# EAGLE board domeLedPcb (EAGLE 7.5.0), part 1 of 2
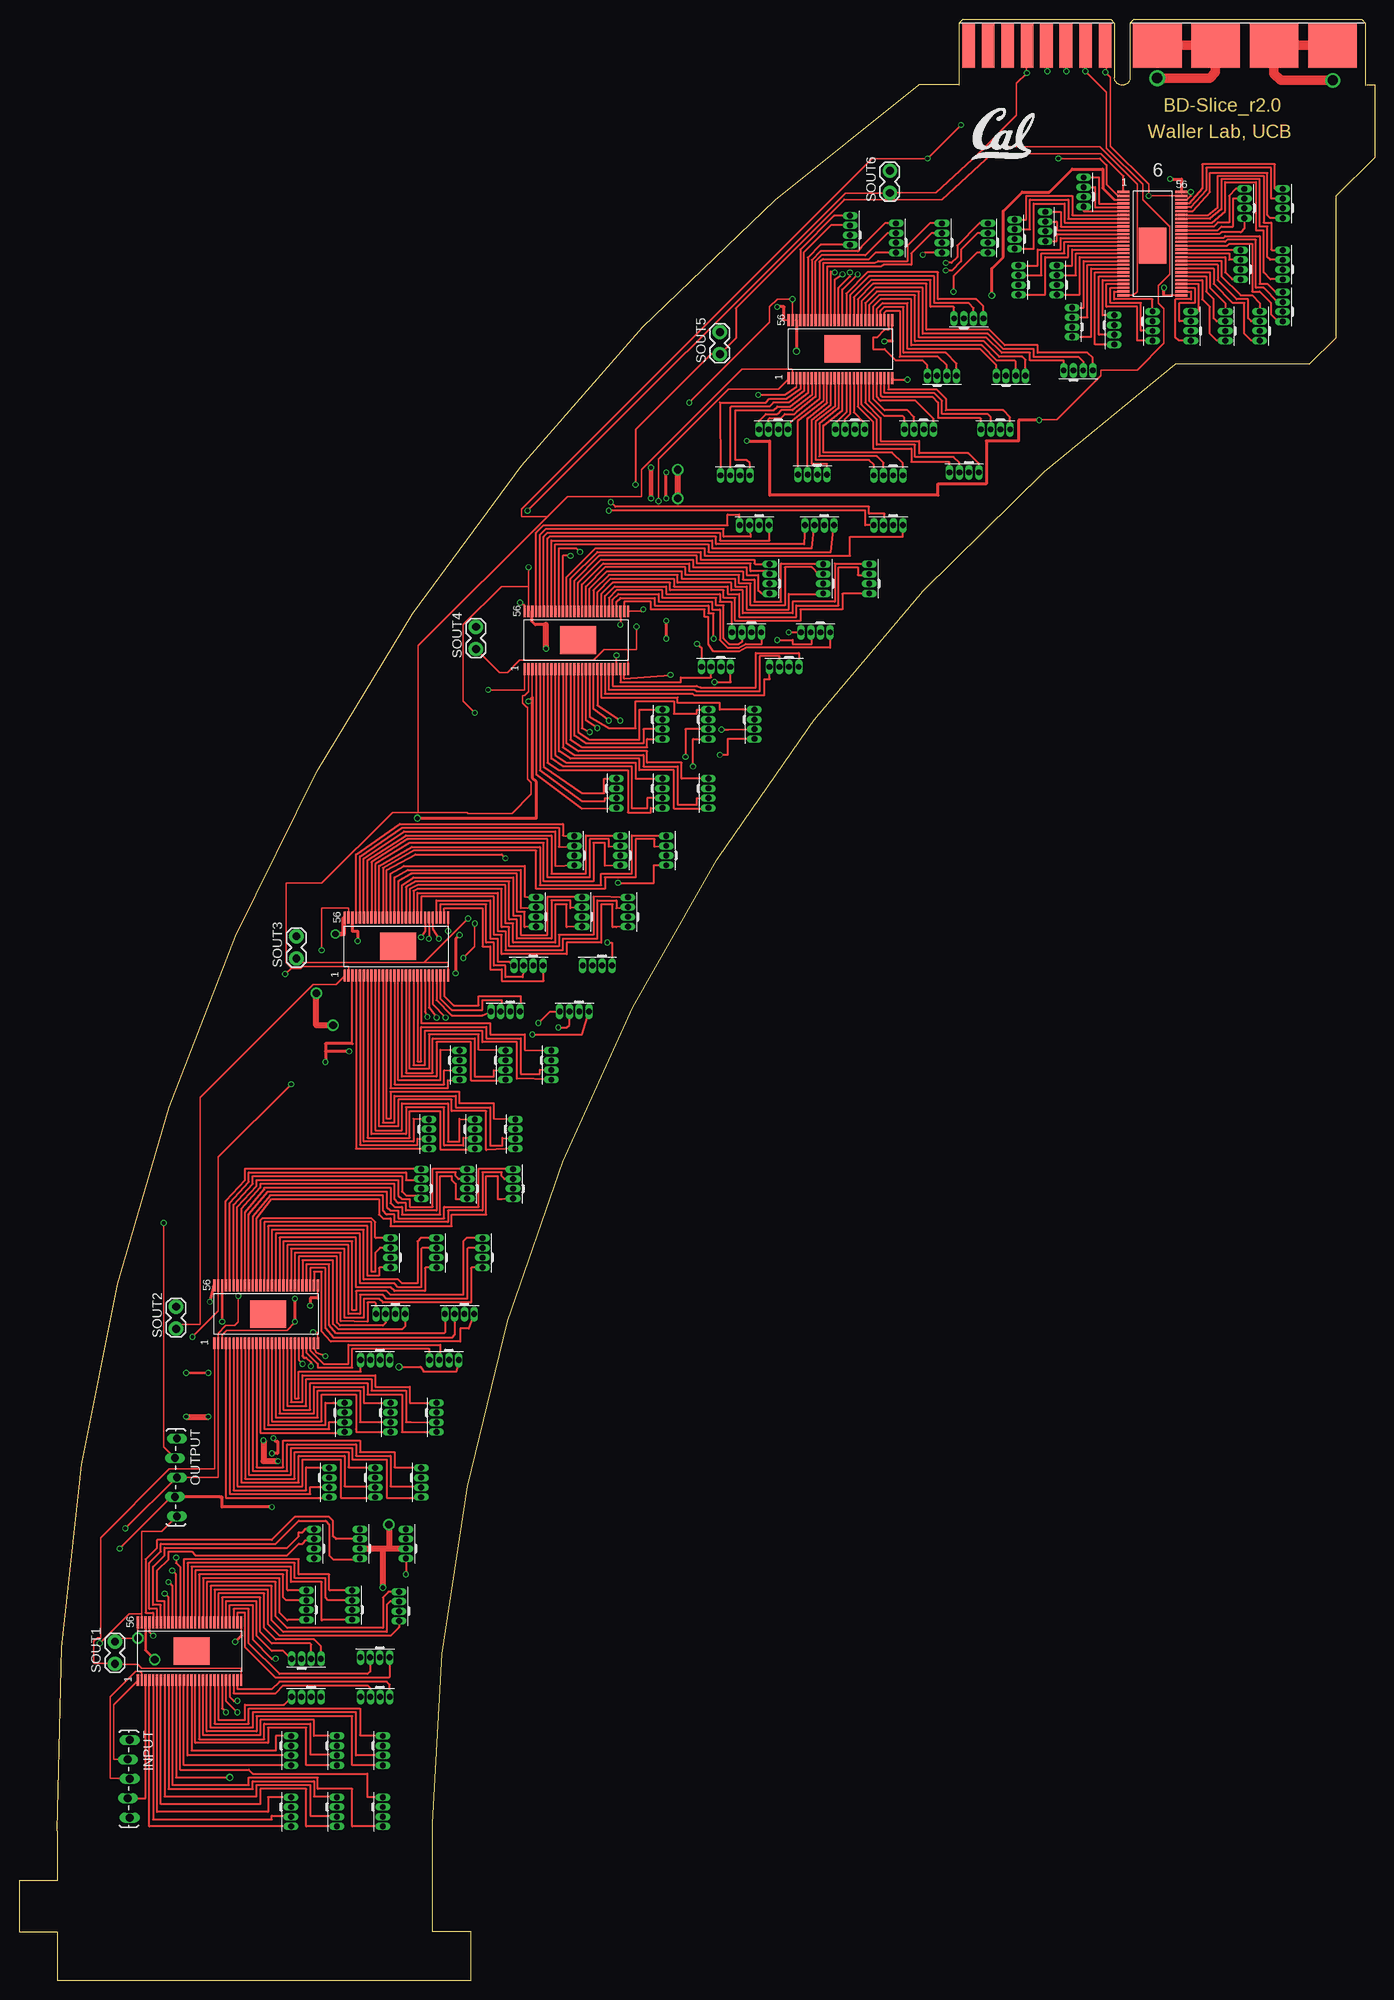
[diagram p5: board, top side]
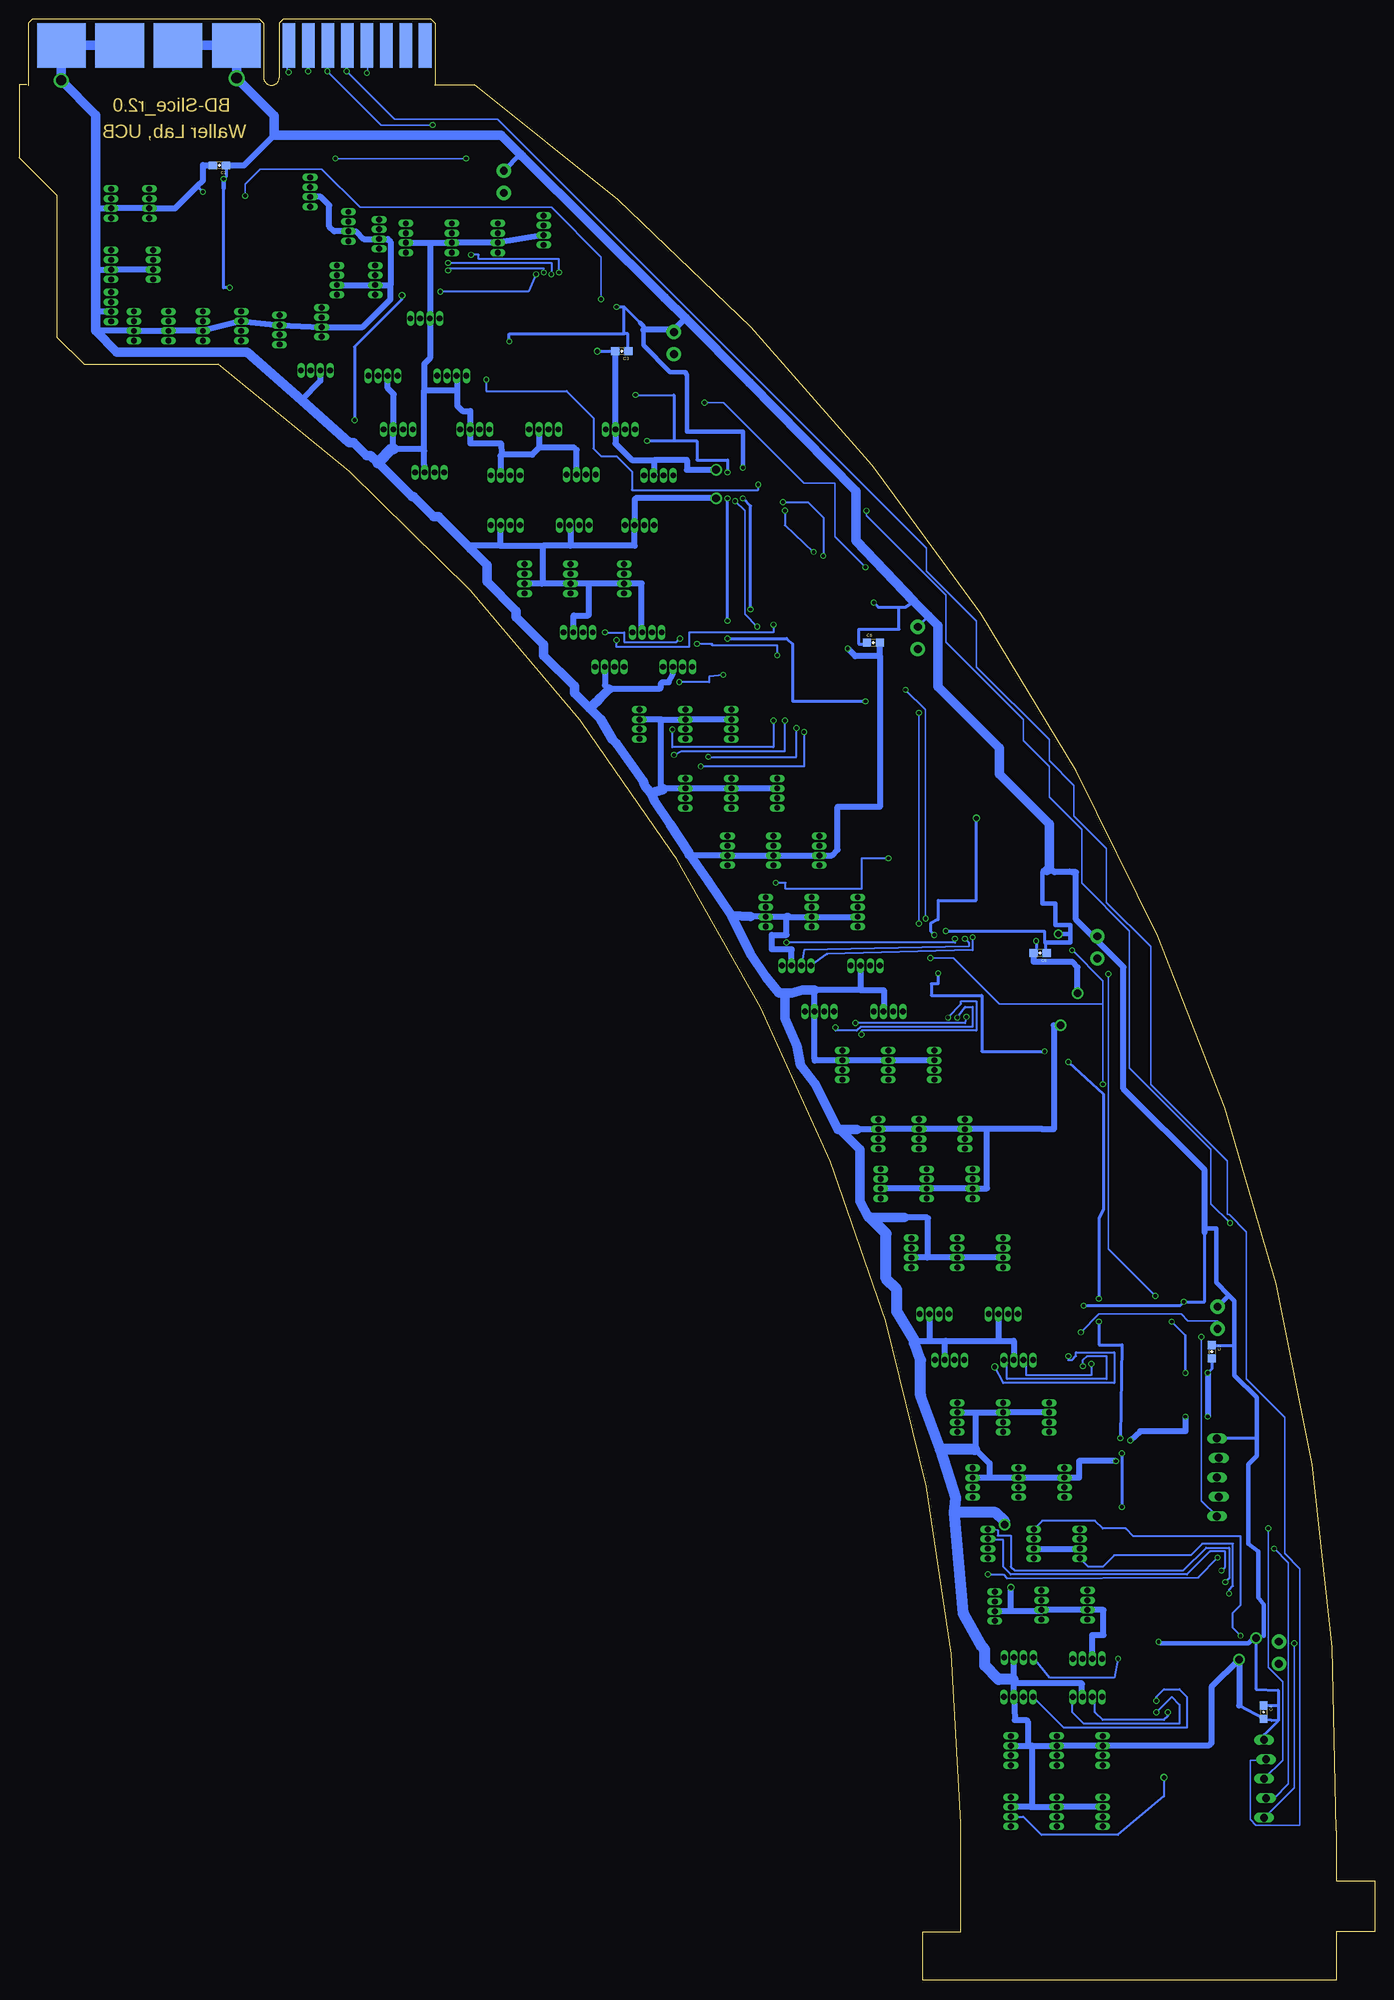
[diagram p6: board, bottom side, seen from below]

Size 177 x 256.07 mm. Coordinates in mm from the lower left corner, seen from the top.
Outline: 176,247.5 177,247.5 177,238 172,233 172,214.5 168.5,211 151,211 arc53 54,20.5 54,6.35 59,6.35 59,0 5,0 5,6.35 0,6.35 0,13 5,13 5,19.5 arc-55 117.5,247.5 122.72,247.5 122.71,247.41
Copper layers (1*16): Top 0.035mm / dielectric 1.5mm / Bottom 0.035mm
Design rules "SparkFun *": minimum track width 8mil, minimum drill 20mil, track to track 8mil, track to pad 8mil, pad to pad 8mil, via to via 8mil, smd to smd 8mil, copper to edge 10mil, drill to drill 8mil, minimum pad ring 0mil, minimum via ring 0mil, stop-mask expansion 4mil, vias tented up to drill 25mil, thermal gap 10mil

## Footprints (pad centres in the part's own frame; a part is rotated, then mirrored left to right if it is on the bottom)
4POWER_8SIGNAL = smd 6.35 x 5.842 bottom: A1_B -27.432,-0.381; A2_B -19.812,-0.381; A3_B -12.192,-0.381; A4_B -4.572,-0.381 | smd 6.35 x 5.842: A1_T -27.432,-0.381; A2_T -19.812,-0.381; A3_T -12.192,-0.381; A4_T -4.572,-0.381 | smd 1.651 x 5.842 bottom: B1_B 2.261,-0.381; B2_B 4.801,-0.381; B3_B 7.366,-0.381; B4_B 9.906,-0.381; B5_B 12.446,-0.381; B6_B 14.986,-0.381; B7_B 17.526,-0.381; B8_B 20.066,-0.381 | smd 1.651 x 5.842: B1_T 2.261,-0.381; B2_T 4.801,-0.381; B3_T 7.366,-0.381; B4_T 9.906,-0.381; B5_T 12.446,-0.381; B6_T 14.986,-0.381; B7_T 17.526,-0.381; B8_T 20.066,-0.381
0603-CAP = smd 1.1 x 1: 1 -0.85,0; 2 0.85,0
56-HTSSOP = smd 0.3 x 1.55: P1 -7,-3.8; P2 -6.5,-3.8; P3 -6,-3.8; P4 -5.5,-3.8; P5 -5,-3.8; P6 -4.5,-3.8; P7 -4,-3.8; P8 -3.5,-3.8; P9 -3,-3.8; P10 -2.5,-3.8; P11 -2,-3.8; P12 -1.5,-3.8; P13 -1,-3.8; P14 -0.5,-3.8; P15 0,-3.8; P16 0.5,-3.8; P17 1,-3.8; P18 1.5,-3.8; P19 2,-3.8; P20 2.5,-3.8; P21 3,-3.8; P22 3.5,-3.8; P23 4,-3.8; P24 4.5,-3.8; P25 5,-3.8; P26 5.5,-3.8; P27 6,-3.8; P28 6.5,-3.8; P29 6.5,3.75; P30 6,3.75; P31 5.5,3.75; P32 5,3.75; P33 4.5,3.75; P34 4,3.75; P35 3.5,3.75; P36 3,3.75; P37 2.5,3.75; P38 2,3.75; P39 1.5,3.75; P40 1,3.75; P41 0.5,3.75; P42 0,3.75; P43 -0.5,3.75; P44 -1,3.75; P45 -1.5,3.75; P46 -2,3.75; P47 -2.5,3.75; P48 -3,3.75; P49 -3.5,3.75; P50 -4,3.75; P51 -4.5,3.75; P52 -5,3.75; P53 -5.5,3.75; P54 -6,3.75; P55 -6.5,3.75; P56 -7,3.75 | smd 4.7 x 3.6: POWER_PAD 0,0
LED-RGB-THRU = drill 0.762 pad 0.889 long: 1 1.905,0; 2 0.635,0; 3 -0.635,0; 4 -1.905,0
1X05_LOCK_LONGPADS = drill 1.016 long: 1 0,0; 2 2.54,-0.254; 3 5.08,0; 4 7.62,-0.254; 5 10.16,0
1X02_LOCK = drill 1.016 pad 1.88: 1 -0.178,0; 2 2.718,0

## Placement (x,y rotation side)
BASE_CONNECTOR  4POWER_8SIGNALMATING_BOARD  [4POWER_8SIGNAL]  144.05,252.26 180 top
C1  0.1uF  [0603-CAP]  150.83,236.98 180 bottom
C2  0.1uF  [0603-CAP]  21.25,82.06 270 bottom
C3  0.1uF  [0603-CAP]  98.29,212.71 180 bottom
C4  0.1uF  [0603-CAP]  14.5,35 270 bottom
C5  0.1uF  [0603-CAP]  65.45,174.66 0 bottom
C6  0.1uF  [0603-CAP]  43.69,134.14 180 bottom
CHIP_1  TLC5955V0  [56-HTSSOP]  22.5,43 0 top
CHIP_2  TLC5955V0  [56-HTSSOP]  32.5,87 0 top
CHIP_3  TLC5955V0  [56-HTSSOP]  49.5,135 0 top
CHIP_4  TLC5955V0  [56-HTSSOP]  73,175 0 top
CHIP_5  TLC5955V0  [56-HTSSOP]  107.5,213 0 top
CHIP_6  TLC5955V0  [56-HTSSOP]  148,226.5 270 top
D1  LED-RGB-CC-THRUCLEAR  [LED-RGB-THRU]  159.5,224 270 top
D2  LED-RGB-CC-THRUCLEAR  [LED-RGB-THRU]  162,216 270 top
D3  LED-RGB-CC-THRUCLEAR  [LED-RGB-THRU]  137.5,216.5 270 top
D4  LED-RGB-CC-THRUCLEAR  [LED-RGB-THRU]  153,216 270 top
D5  LED-RGB-CC-THRUCLEAR  [LED-RGB-THRU]  165,232 270 top
D6  LED-RGB-CC-THRUCLEAR  [LED-RGB-THRU]  160,232 270 top
D7  LED-RGB-CC-THRUCLEAR  [LED-RGB-THRU]  135.5,222 270 top
D8  LED-RGB-CC-THRUCLEAR  [LED-RGB-THRU]  134,229 270 top
D9  LED-RGB-CC-THRUCLEAR  [LED-RGB-THRU]  157.5,216 270 top
D10  LED-RGB-CC-THRUCLEAR  [LED-RGB-THRU]  130,228 270 top
D11  LED-RGB-CC-THRUDIFFUSE  [LED-RGB-THRU]  130.5,222 270 top
D12  LED-RGB-CC-THRUCLEAR  [LED-RGB-THRU]  148,216 90 top
D13  LED-RGB-CC-THRUCLEAR  [LED-RGB-THRU]  165,218.5 270 top
D14  LED-RGB-CC-THRUCLEAR  [LED-RGB-THRU]  165,224 270 top
D15  LED-RGB-CC-THRUCLEAR  [LED-RGB-THRU]  143,215.5 90 top
D16  LED-RGB-CC-THRUCLEAR  [LED-RGB-THRU]  139,233.5 270 top
D17  LED-RGB-CC-THRUCLEAR  [LED-RGB-THRU]  105,183 270 top
D18  LED-RGB-CC-THRUCLEAR  [LED-RGB-THRU]  111,183 270 top
D19  LED-RGB-CC-THRUCLEAR  [LED-RGB-THRU]  96,164 90 top
D20  LED-RGB-CC-THRUCLEAR  [LED-RGB-THRU]  104,176 0 top
D21  LED-RGB-CC-THRUCLEAR  [LED-RGB-THRU]  96,190 0 top
D22  LED-RGB-CC-THRUCLEAR  [LED-RGB-THRU]  113.5,190 0 top
D23  LED-RGB-CC-THRUCLEAR  [LED-RGB-THRU]  90,164 90 top
D24  LED-RGB-CC-THRUCLEAR  [LED-RGB-THRU]  90,155 90 top
D25  LED-RGB-CC-THRUCLEAR  [LED-RGB-THRU]  95,176 0 top
D26  LED-RGB-CC-THRUCLEAR  [LED-RGB-THRU]  84,155 90 top
D27  LED-RGB-CC-THRUCLEAR  [LED-RGB-THRU]  84,164 90 top
D28  LED-RGB-CC-THRUCLEAR  [LED-RGB-THRU]  91,171.5 0 top
D29  LED-RGB-CC-THRUCLEAR  [LED-RGB-THRU]  98,183 270 top
D30  LED-RGB-CC-THRUCLEAR  [LED-RGB-THRU]  104.5,190 0 top
D31  LED-RGB-CC-THRUCLEAR  [LED-RGB-THRU]  99.9,171.5 0 top
D32  LED-RGB-CC-THRUCLEAR  [LED-RGB-THRU]  78,155 90 top
D33  LED-RGB-CC-THRUCLEAR  [LED-RGB-THRU]  124,217 180 top
D34  LED-RGB-CC-THRUCLEAR  [LED-RGB-THRU]  138.3,210.2 180 top
D35  1  [LED-RGB-THRU]  123.4,196.9 0 top
D36  LED-RGB-CC-THRUCLEAR  [LED-RGB-THRU]  120.5,209.5 180 top
D37  LED-RGB-CC-THRUCLEAR  [LED-RGB-THRU]  108.5,228.5 270 top
D38  LED-RGB-CC-THRUCLEAR  [LED-RGB-THRU]  120.5,227.5 270 top
D39  LED-RGB-CC-THRUCLEAR  [LED-RGB-THRU]  108.5,202.5 0 top
D40  LED-RGB-CC-THRUCLEAR  [LED-RGB-THRU]  103.6,196.6 0 top
D41  LED-RGB-CC-THRUCLEAR  [LED-RGB-THRU]  129.5,209.5 180 top
D42  LED-RGB-CC-THRUCLEAR  [LED-RGB-THRU]  98.5,202.5 0 top
D43  LED-RGB-CC-THRUCLEAR  [LED-RGB-THRU]  113.5,196.5 0 top
D44  LED-RGB-CC-THRUCLEAR  [LED-RGB-THRU]  127.5,202.5 0 top
D45  LED-RGB-CC-THRUCLEAR  [LED-RGB-THRU]  126.5,227.5 270 top
D46  LED-RGB-CC-THRUCLEAR  [LED-RGB-THRU]  114.5,227.5 270 top
D47  LED-RGB-CC-THRUCLEAR  [LED-RGB-THRU]  117.5,202.5 0 top
D48  LED-RGB-CC-THRUCLEAR  [LED-RGB-THRU]  93.5,196.5 0 top
D49  LED-RGB-CC-THRUCLEAR  [LED-RGB-THRU]  37.5,49 270 top
D50  LED-RGB-CC-THRUCLEAR  [LED-RGB-THRU]  49.6,48.83 270 top
D51  LED-RGB-CC-THRUCLEAR  [LED-RGB-THRU]  47.5,30 90 top
D52  LED-RGB-CC-THRUCLEAR  [LED-RGB-THRU]  46.47,42.16 0 top
D53  LED-RGB-CC-THRUCLEAR  [LED-RGB-THRU]  44.5,57 270 top
D54  LED-RGB-CC-THRUCLEAR  [LED-RGB-THRU]  50.5,57 270 top
D55  LED-RGB-CC-THRUCLEAR  [LED-RGB-THRU]  41.5,30 90 top
D56  LED-RGB-CC-THRUCLEAR  [LED-RGB-THRU]  47.5,22 90 top
D57  LED-RGB-CC-THRUCLEAR  [LED-RGB-THRU]  37.5,42 180 top
D58  LED-RGB-CC-THRUCLEAR  [LED-RGB-THRU]  41.5,22 90 top
D59  LED-RGB-CC-THRUCLEAR  [LED-RGB-THRU]  35.5,30 90 top
D60  LED-RGB-CC-THRUCLEAR  [LED-RGB-THRU]  46.5,37 0 top
D61  LED-RGB-CC-THRUCLEAR  [LED-RGB-THRU]  43.5,49 270 top
D62  LED-RGB-CC-THRUCLEAR  [LED-RGB-THRU]  38.5,57 270 top
D63  LED-RGB-CC-THRUCLEAR  [LED-RGB-THRU]  37.5,37 0 top
D64  LED-RGB-CC-THRUCLEAR  [LED-RGB-THRU]  35.5,22 90 top
D65  LED-RGB-CC-THRUCLEAR  [LED-RGB-THRU]  54.5,95 270 top
D66  LED-RGB-CC-THRUCLEAR  [LED-RGB-THRU]  60.5,95 270 top
D67  LED-RGB-CC-THRUCLEAR  [LED-RGB-THRU]  54.5,73.5 90 top
D68  LED-RGB-CC-THRUCLEAR  [LED-RGB-THRU]  57.5,87 0 top
D69  LED-RGB-CC-THRUCLEAR  [LED-RGB-THRU]  52.5,104 270 top
D70  LED-RGB-CC-THRUCLEAR  [LED-RGB-THRU]  64.5,104 270 top
D71  LED-RGB-CC-THRUCLEAR  [LED-RGB-THRU]  48.5,73.5 90 top
D72  LED-RGB-CC-THRUCLEAR  [LED-RGB-THRU]  52.5,65 90 top
D73  LED-RGB-CC-THRUCLEAR  [LED-RGB-THRU]  48.5,87 0 top
D74  LED-RGB-CC-THRUCLEAR  [LED-RGB-THRU]  46.5,65 90 top
D75  LED-RGB-CC-THRUCLEAR  [LED-RGB-THRU]  42.5,73.5 90 top
D76  LED-RGB-CC-THRUCLEAR  [LED-RGB-THRU]  55.5,81 0 top
D77  LED-RGB-CC-THRUCLEAR  [LED-RGB-THRU]  48.5,95 270 top
D78  LED-RGB-CC-THRUCLEAR  [LED-RGB-THRU]  58.5,104 270 top
D79  LED-RGB-CC-THRUCLEAR  [LED-RGB-THRU]  46.5,81 0 top
D80  LED-RGB-CC-THRUCLEAR  [LED-RGB-THRU]  40.5,65 90 top
D81  LED-RGB-CC-THRUCLEAR  [LED-RGB-THRU]  73.5,139.5 270 top
D82  LED-RGB-CC-THRUCLEAR  [LED-RGB-THRU]  79.5,139.5 270 top
D83  LED-RGB-CC-THRUCLEAR  [LED-RGB-THRU]  69.5,119.5 90 top
D84  LED-RGB-CC-THRUCLEAR  [LED-RGB-THRU]  66.5,132.5 0 top
D85  LED-RGB-CC-THRUCLEAR  [LED-RGB-THRU]  72.5,147.5 270 top
D86  LED-RGB-CC-THRUCLEAR  [LED-RGB-THRU]  84.5,147.5 270 top
D87  LED-RGB-CC-THRUCLEAR  [LED-RGB-THRU]  63.5,119.5 90 top
D88  LED-RGB-CC-THRUCLEAR  [LED-RGB-THRU]  64.8,110.5 90 top
D89  LED-RGB-CC-THRUCLEAR  [LED-RGB-THRU]  75.5,132.5 0 top
D90  LED-RGB-CC-THRUCLEAR  [LED-RGB-THRU]  59.5,110.5 90 top
D91  LED-RGB-CC-THRUCLEAR  [LED-RGB-THRU]  57.5,119.5 90 top
D92  LED-RGB-CC-THRUCLEAR  [LED-RGB-THRU]  63.5,126.5 0 top
D93  LED-RGB-CC-THRUCLEAR  [LED-RGB-THRU]  67.5,139.5 270 top
D94  LED-RGB-CC-THRUCLEAR  [LED-RGB-THRU]  78.5,147.5 270 top
D95  LED-RGB-CC-THRUCLEAR  [LED-RGB-THRU]  72.5,126.5 0 top
D96  LED-RGB-CC-THRUCLEAR  [LED-RGB-THRU]  53.5,110.5 90 top
INPUT  [1X05_LOCK_LONGPADS]  14.44,31.4 270 top
OUTPUT  [1X05_LOCK_LONGPADS]  20.6,70.75 270 top
SOUT1  [1X02_LOCK]  12.5,41.5 90 top
SOUT2  [1X02_LOCK]  20.5,85.25 90 top
SOUT3  [1X02_LOCK]  36.2,133.6 90 top
SOUT4  [1X02_LOCK]  59.65,174 90 top
SOUT5  [1X02_LOCK]  91.5,212.5 90 top
SOUT6  [1X02_LOCK]  113.7,233.56 90 top